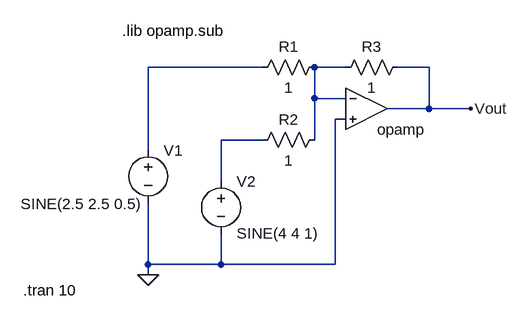
[diagram p0: schematic VoltageAdder.asc]
VoltageAdder.asc, the LTspice schematic file:
Version 4
SHEET 1 880 680
WIRE 192 32 16 32
WIRE 320 32 272 32
WIRE 448 32 400 32
WIRE 272 80 272 32
WIRE 320 80 272 80
WIRE 448 96 448 32
WIRE 448 96 384 96
WIRE 512 96 448 96
WIRE 320 112 304 112
WIRE 192 144 128 144
WIRE 272 144 272 80
WIRE 16 160 16 32
WIRE 128 208 128 144
WIRE 16 336 16 240
WIRE 128 336 128 288
WIRE 128 336 16 336
WIRE 304 336 304 112
WIRE 304 336 128 336
WIRE 16 352 16 336
FLAG 16 352 0
FLAG 512 96 Vout
SYMBOL voltage 16 144 R0
WINDOW 123 0 0 Left 2
WINDOW 39 0 0 Left 2
WINDOW 3 -196 99 Left 2
SYMATTR InstName V1
SYMATTR Value SINE(2.5 2.5 0.5)
SYMBOL voltage 128 192 R0
WINDOW 123 0 0 Left 2
WINDOW 39 0 0 Left 2
SYMATTR InstName V2
SYMATTR Value SINE(4 4 1)
SYMBOL res 288 16 R90
WINDOW 0 0 56 VBottom 2
WINDOW 3 32 56 VTop 2
SYMATTR InstName R1
SYMATTR Value 1
SYMBOL res 288 128 R90
WINDOW 0 0 56 VBottom 2
WINDOW 3 32 56 VTop 2
SYMATTR InstName R2
SYMATTR Value 1
SYMBOL Opamps\\opamp 352 32 R0
WINDOW 0 0 32 Invisible 2
SYMATTR InstName U1
SYMBOL res 416 16 R90
WINDOW 0 0 56 VBottom 2
WINDOW 3 32 56 VTop 2
SYMATTR InstName R3
SYMATTR Value 1
TEXT -24 -24 Left 2 !.lib opamp.sub
TEXT -176 376 Left 2 !.tran 10

The netlist it stands for:
* VoltageAdder.asc
V1 N001 0 SINE(2.5 2.5 0.5)
V2 N003 0 SINE(4 4 1)
R1 N002 N001 1
R2 N002 N003 1
XU1 N002 0 Vout opamp Aol=100K GBW=10Meg  ; pins invin noninvin out
R3 Vout N002 1
.lib opamp.sub
.tran 10
.backanno
.end